# Altium schematic sheet Esquematico.SchDoc
size A4
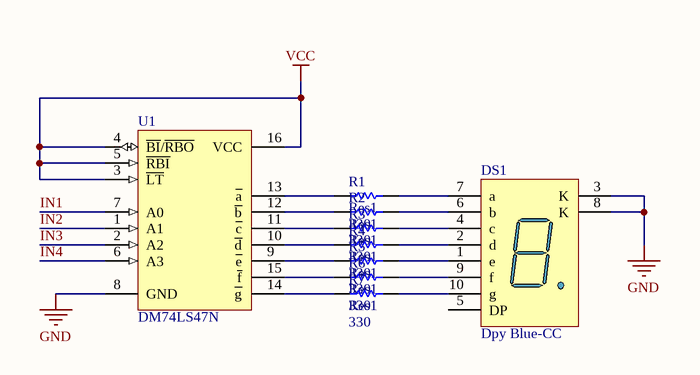
[diagram p0: Esquematico.SchDoc]

## Parts
DS1  Dpy Blue-CC  [H]
R1  Res1  value 330  [AXIAL-0.3]
R2  Res1  value 330  [AXIAL-0.3]
R3  Res1  value 330  [AXIAL-0.3]
R4  Res1  value 330  [AXIAL-0.3]
R5  Res1  value 330  [AXIAL-0.3]
R6  Res1  value 330  [AXIAL-0.3]
R7  Res1  value 330  [AXIAL-0.3]
U1  DM74LS47N  [N16E]

## Nets
GND: DS1.3(K) DS1.8(K) U1.8(GND)
VCC: U1.3(~{LT}) U1.4(~{BI}/~{RBO}) U1.5(~{RBI}) U1.16(VCC)
IN1: U1.7(A0)
IN2: U1.1(A1)
IN3: U1.2(A2)
IN4: U1.6(A3)
NetDS1_1: DS1.1(e) R5.2
NetDS1_2: DS1.2(d) R4.2
NetDS1_4: DS1.4(c) R3.2
NetDS1_6: DS1.6(b) R2.2
NetDS1_7: DS1.7(a) R1.2
NetDS1_9: DS1.9(f) R6.2
NetDS1_10: DS1.10(g) R7.2
NetR1_1: R1.1 U1.13(~{a})
NetR2_1: R2.1 U1.12(~{b})
NetR3_1: R3.1 U1.11(~{c})
NetR4_1: R4.1 U1.10(~{d})
NetR5_1: R5.1 U1.9(~{e})
NetR6_1: R6.1 U1.15(~{f})
NetR7_1: R7.1 U1.14(~{g})

Not connected (* = marked no-connect by the designer): DS1 5(DP)

## Library data of the parts
DS1 = Dpy Blue-CC: 14.2 mm General Purpose Blue 7-Segment Display: CC, RH DP, Gray Surface; MinimumIntensity: 2020 ucd; Note: IF = 10 mA; Published: 8-Jun-2000; LatestRevisionDate: 17-Dec-2003; LatestRevisionNote: Schematic revised, PCB Footprint replaced.; DatasheetVersion: 24-Sep-2002; PackageVersion: 24-Sep-2002; PackageReference: H; Publisher: Altium Limited; PackageDescription: LED, 7-Segment Display, 14.2 mm, RHD; 10 Leads; Row Space 15.24 mm; Pitch 2.54 mm; Colour: Blue; ComponentLink1Description: Manufacturer Link; ComponentLink1URL: http://www.agilent.com/
R1-R7 = Res1: Resistor; Published: 8-Jun-2000; LatestRevisionDate: 17-Jul-2002; LatestRevisionNote: Re-released for DXP Platform.; PackageReference: AXIAL-0.3; Publisher: Altium Limited; PackageDescription: Axial Device, Thru-Hole; 2 Leads; 0.3 in Pin Spacing
U1 = DM74LS47N: BCD to 7-Segment Decoder/Driver with Open-Collector Output; Published: 17-Jul-2002; LatestRevisionDate: 04-Mar-2005; LatestRevisionNote: Stylized 3D Model Added.; DatasheetVersion: Mar-1998; PackageVersion: 2000; PackageReference: N16E; Publisher: Altium Limited; PackageDescription: DIP, 16-Pin, Row Spacing 7.62 mm, Pitch 2.54 mm; ComponentLink1Description: Manufacturer Link; ComponentLink1URL: http://www.fairchildsemi.com/